# EAGLE design Adafruit Feather Teensy3 Adapter (EAGLE 6.6.0)
COMPANY: ADAFRUIT INDUSTRIES; DRAWN: KTOWN; REV: B
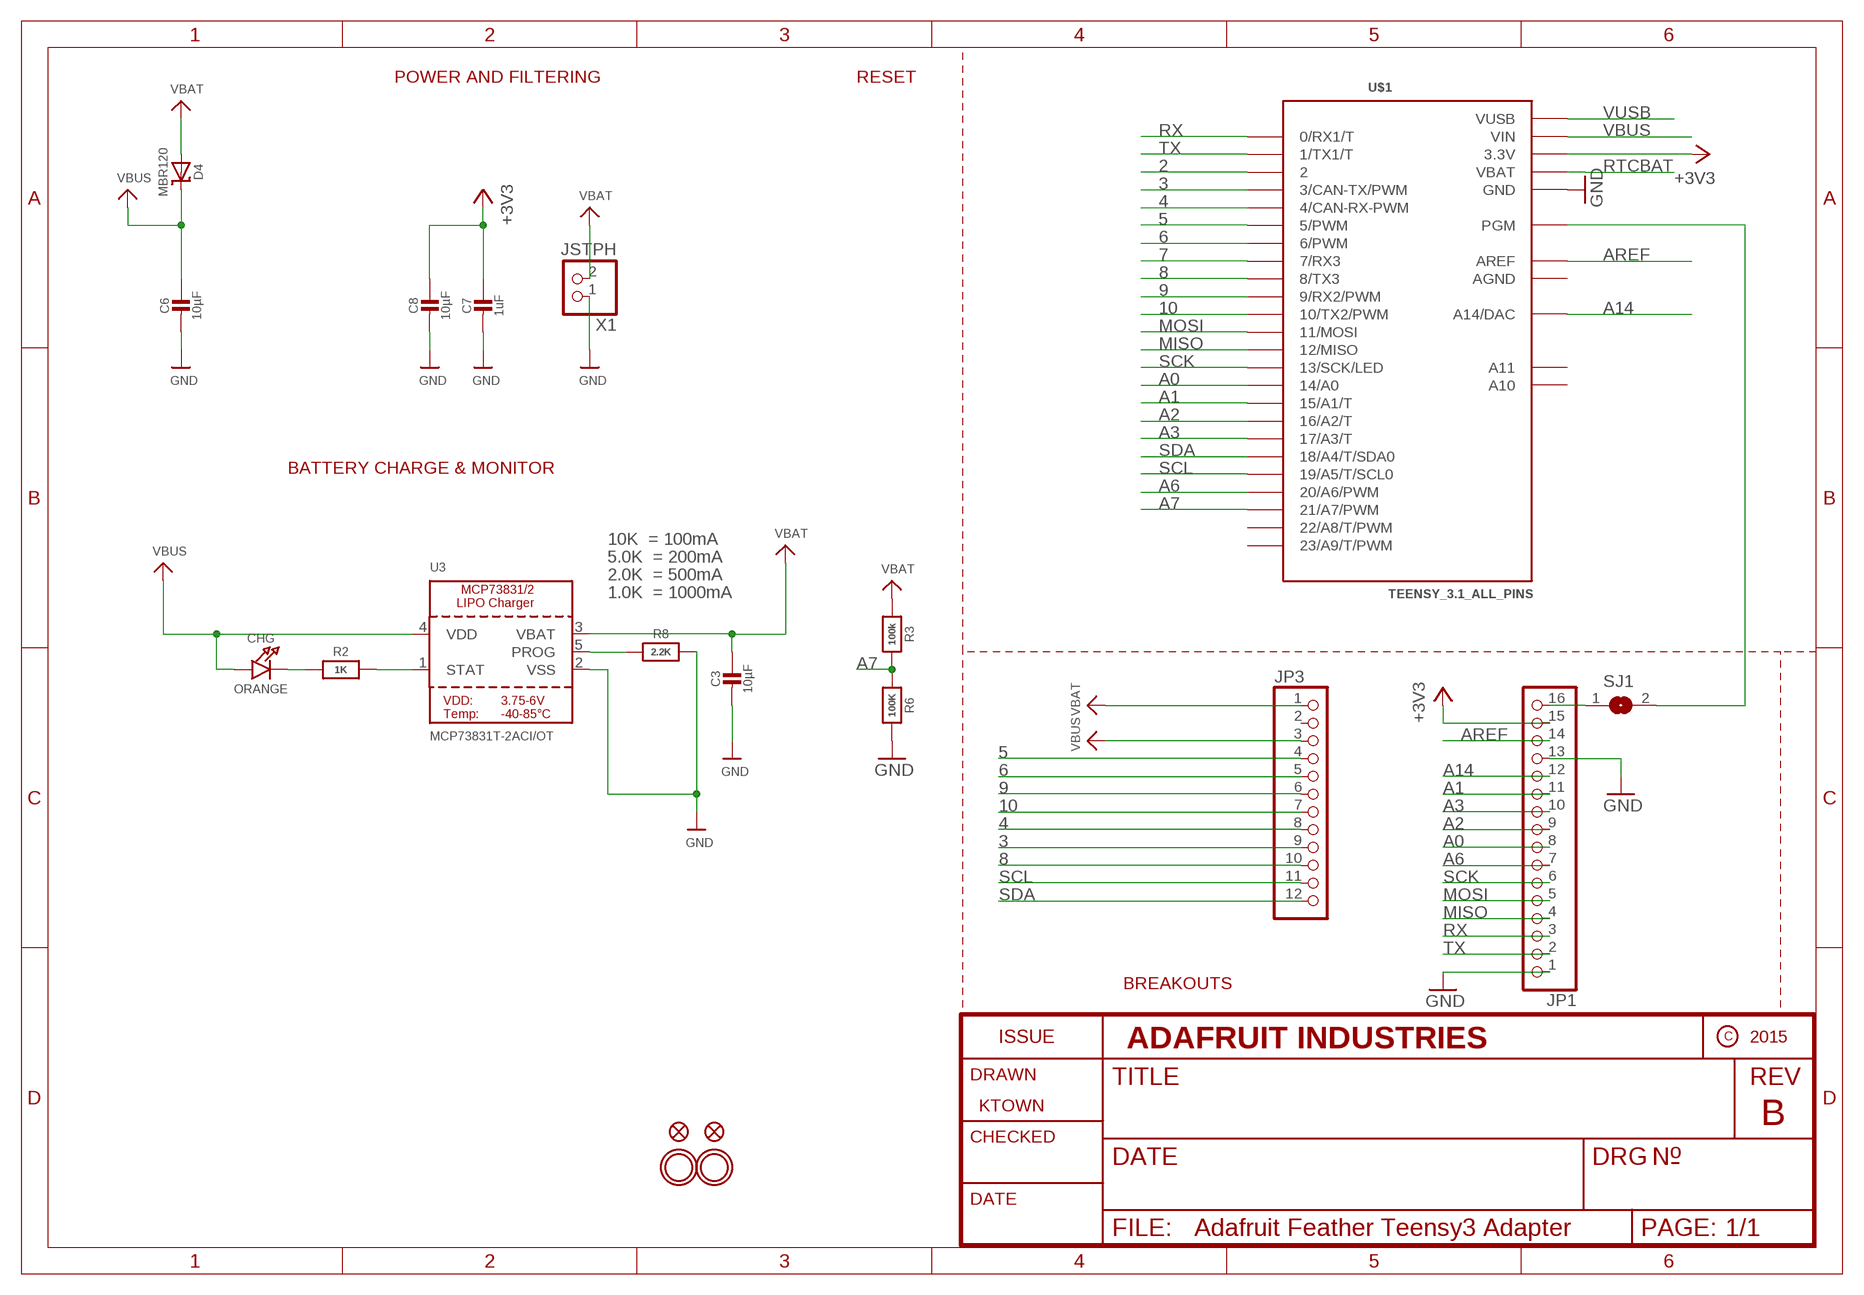
[diagram p0: schematic, sheet 1]

## Parts
C3  10µF  CAP_CERAMIC0805-NOOUTLINE  [0805-NO]
C6  10µF  CAP_CERAMIC0805-NOOUTLINE  [0805-NO]
C7  1uF  CAP_CERAMIC0603_NO  [0603-NO]
C8  10µF  CAP_CERAMIC0805-NOOUTLINE  [0805-NO]
CHG  ORANGE  LED0805_NOOUTLINE  [CHIPLED_0805_NOOUTLINE]
D4  MBR120  DIODE-SCHOTTKYSOD-123  [SOD-123]
JP1  HEADER-1X16ROUND  [1X16_ROUND]
JP3  HEADER-1X12  [1X12_ROUND]
R2  1K  RESISTOR_0603_NOOUT  [0603-NO]
R3  100k  RESISTOR_0603_NOOUT  [0603-NO]
R6  100K  RESISTOR_0603_NOOUT  [0603-NO]
R8  2.2K  RESISTOR_0603_NOOUT  [0603-NO]
SJ1  SOLDERJUMPERCLOSED  [SOLDERJUMPER_CLOSEDWIRE]
U3  MCP73831T-2ACI/OT  MCP73831/2  [SOT23-5]
U$1  TEENSY_3.1_ALL_PINS  [TEENSY3-ALL_PINS]
U$31  MOUNTINGHOLE2.5  [MOUNTINGHOLE_2.5_PLATED]
U$32  MOUNTINGHOLE2.5  [MOUNTINGHOLE_2.5_PLATED]
U$34  FIDUCIAL""  [FIDUCIAL_1MM]
U$35  FIDUCIAL""  [FIDUCIAL_1MM]
X1  JSTPH  CON_JST_PH_2PIN  [JSTPH2]

## Nets
2: U$1.2
3: JP3.9 U$1.3(3/CAN-TX/PWM)
4: JP3.8 U$1.4(4/CAN-RX-PWM)
5: JP3.4 U$1.5(5/PWM)
6: JP3.5 U$1.6(6/PWM)
7: U$1.7(7/RX3)
8: JP3.10 U$1.8(8/TX3)
9: JP3.6 U$1.9(9/RX2/PWM)
10: JP3.7 U$1.10(10/TX2/PWM)
+3V3: C7.1 C8.1 JP1.15 U$1.3.3V U$1.3.3V1(3.3V)
A0: JP1.8 U$1.14/A0
A1: JP1.11 U$1.15/A1(15/A1/T)
A2: JP1.9 U$1.16/A2(16/A2/T)
A3: JP1.10 U$1.17/A3(17/A3/T)
A6: JP1.7 U$1.20/A6(20/A6/PWM)
A7: R3.2 R6.1 U$1.21/A7(21/A7/PWM)
A14: JP1.12 U$1.RESET/DAC(A14/DAC)
AREF: JP1.14 U$1.AREF
BOOT: SJ1.2 U$1.PGM
GND: C3.2 C6.2 C7.2 C8.2 JP1.1 JP1.13 R6.2 R8.2 U3.2(VSS) U$1.GND U$1.GND1(GND) X1.1
MISO: JP1.4 U$1.12(12/MISO)
MOSI: JP1.5 U$1.11(11/MOSI)
N$1: CHG.C R2.1
N$3: R2.2 U3.1(STAT)
N$4: R8.1 U3.5(PROG)
RST/BOOT: JP1.16 SJ1.1
RTCBAT: U$1.VBAT
RX: JP1.3 U$1.0(0/RX1/T)
SCK: JP1.6 U$1.13(13/SCK/LED)
SCL: JP3.11 U$1.19/A5(19/A5/T/SCL0)
SDA: JP3.12 U$1.18/A4(18/A4/T/SDA0)
TX: JP1.2 U$1.1(1/TX1/T)
VBAT: C3.1 D4.A JP3.1 R3.1 U3.3(VBAT) X1.2
VBUS: C6.1 CHG.A D4.C JP3.3 U3.4(VDD) U$1.VIN
VUSB: U$1.VUSB
Unconnected: JP3.2 U$1.22/A8(22/A8/T/PWM) U$1.23/A9(23/A9/T/PWM) U$1.A10 U$1.A11

## Notes on the sheet
- POWER AND FILTERING | RESET
- BATTERY CHARGE & MONITOR
- 10K  = 100mA
- 5.0K  = 200mA
- 2.0K  = 500mA
- 1.0K  = 1000mA
- BREAKOUTS

## Power pins joined to a net without a drawn wire
AGND: U$1.AGND

## Library data of the parts
C3 C6-C8 = microbuilder:CAP_CERAMIC: Ceramic Capacitors For new designs, use the packages preceded by an '_' character since they are more reliable: The following footprints should be used on most boards: _0402 - Standard footprint for regular board layouts _0603 - Standard footprint for regular board layouts _0805 - Standard footprint for regular board layouts _1206 - Standard footprint for regular board layouts For extremely tight-pitch boards where space is at a premium, the following 'micro-pitch' footprints can be used (smaller pads, no silkscreen outline, etc.): _0402MP - Micro-pitch footprint for very dense/compact boards _0603MP - Micro-pitch footprint for very dense/compact boards _0805MP - Micro-pitch footprint for very dense/compact boards _1206MP - Micro-pitch footprint for very dense/compact boards
CHG = microbuilder:LED: LED 0603 - 0603 Surface Mount Package 2mA: Green LED - Low Power (3.9mcd, 2ma, 1.7Vf) - Digikey: 475-2709-2-ND Orange LED - Low Power (9.8mcd, 2ma, 1.8Vf) - Digikey: 475-1194-2-ND Red LED - Low Power (5mcd, 2ma, 1.8Vf) - Digikey: 475-1195-2-ND Yellow LED - Low Power (7mcd, 2ma, 1.8Vf) - Digikey: 475-1196-2-ND 5mA: Blue LED - Low Power (17mcd, 5ma, 2.9Vf) - Digikey: LNJ937W8CRACT-ND 0805 - 0805 Surface Mount Package 2mA: Red LED (8.8mcd, 2mA, 1.8Vf, Clear) - Low Power [Digikey: 475-2510-1-ND] Green LED (5mcd, 2mA, 1.8Vf, Clear) - Low Power [Digikey: 475-2730-1-ND] Yellow LED (11.3mcd, 2mA, 1.8Vf, Clear) - Low Power [Digikey: 475-2555-1-ND] 20mA: Red LED (104mcd, 20mA, Diffused) - LS R976 [Digikey: 475-1278-6-ND] Red LED (12mcd, 20mA, 2.0Vf, Clear) - APT2012EC [Digikey: 754-1128-1-ND] Green LED (15mcd, 20mA, 2.2Vf, Clear) - APT2012GC [Digikey: 754-1131-1-ND] Orange LED (160mcd, 20mA, 2.1Vf, Clear) - APT2012SECK [Digikey: 754-1130-1-ND] 1206 - 1206 Surface Mount Package Green LED (26mcd, 20mA, Diffused) - LG N971 [Digikey: 475-1407-6-ND] Red LED (15mcd, 20mA, Diffused) - LH N974 [Digikey: 475-1416-6-ND] Cree - Cree High-Power Surface Mount LEDs XPEBWT-L1-0000-00D50 - White 111lm 350mA 2.9Vf 6200K 110° XTEAWT-00-0000-00000LEE3 - White 114lm 350mA 2.85Vf 5000K 115° Everlight - Everlight 45-21 Series Surface Mount LEDs 45-21/QK2C-B2832AC2CB2/2T - Warm White 2000mcd 20mA 3.25Vf 3050K 120° 45-21/LK2C-B38452C4CB2/2T - Nuetral White 2000mcd 20mA 3.25Vf 4150K 120° 45-21/LK2C-B50634C6CB2/2T - Cold White 2200mcd 20mA 3.25Vf 5650K 120° PLCC2 Reverse Mount LS T77K-J1L2-1-0-2-R18-Z - Red 11.25mcd 2mA 1.8Vf 630nm 120° LO T77K-L1M2-24-Z - Orange 19.6mcd 2mA 1.8Vf 606nm 120° LY T77K-K2M1-26-Z - Yellow 15.7mcd 2mA 1.8Vf 587nm 120°
D4 = microbuilder:DIODE-SCHOTTKY
JP1 = microbuilder:HEADER-1X16: PIN HEADER
JP3 = microbuilder:HEADER-1X12
R2 R3 R6 R8 = microbuilder:RESISTOR: Resistors For new designs, use the packages preceded by an '_' character since they are more reliable: The following footprints should be used on most boards: _0402 - Standard footprint for regular board layouts _0603 - Standard footprint for regular board layouts _0805 - Standard footprint for regular board layouts _1206 - Standard footprint for regular board layouts For extremely tight-pitch boards where space is at a premium, the following 'micro-pitch' footprints can be used (smaller pads, no silkscreen outline, etc.): _0402MP - Micro-pitch footprint for very dense/compact boards _0603MP - Micro-pitch footprint for very dense/compact boards _0805MP - Micro-pitch footprint for very dense/compact boards _1206MP - Micro-pitch footprint for very dense/compact boards
SJ1 = microbuilder:SOLDERJUMPER: SMD Solder JUMPER Solder the two pads together to create a connection, or remove the solder to break it. REFLOW - Use this footprint for solder paste and reflow ovens. WAVE - Use this footprint for hand-soldering (larger pads). CLOSED - Has a trace between the two pads to ensure it is closed by default. The trace needs to be cut to disable the jumper, and can be closed again by creating a solder bridge between the two pads.
U3 = microbuilder:MCP73831/2: MCP73831/2 LIPO Charger VDD: 3.75 - 6V Temp -40 - 85°C Programmable Charge Rate: 15-500mA NOTE: STAT is a tri-state logic output on the MCP73831 and an open-drain output on the MCP73832. SOT23-5 with 4.2V output and tri-state logic on STAT = MCP73831T-2ACI/OT
U$1 = microbuilder:TEENSY_3.1_ALL_PINS: Footprint for Teensy 3.1 or 3.2 board using all through-holes, i.e. the entire perimeter plus the 4 through-holes inboard (A10,A11,AREF, VUSB)
U$31 U$32 = microbuilder:MOUNTINGHOLE: Mounting Hole For #2 screws (0.086"/2.18mm width, 0.094"/2.4mm hole) use 2.5mm; BOM: EXCLUDE
U$34 U$35 = microbuilder:FIDUCIAL: Fiducial Alignment Points Various fiducial points for machine vision alignment.; BOM: EXCLUDE
X1 = microbuilder:CON_JST_PH_2PIN: JST 2-Pin Right-Angle Connector PH-Series - 4UConnector: 17311 SH-Series - 4UConnector: 07278

## Board
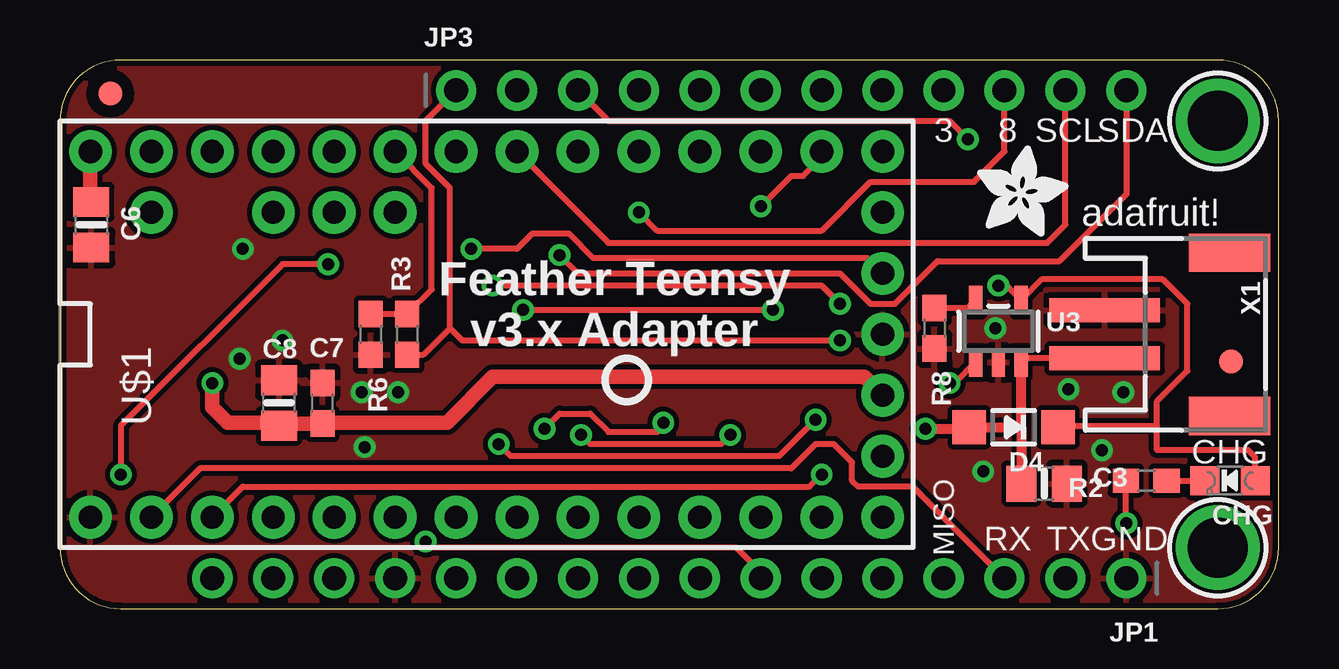
[diagram p1: board, top side]
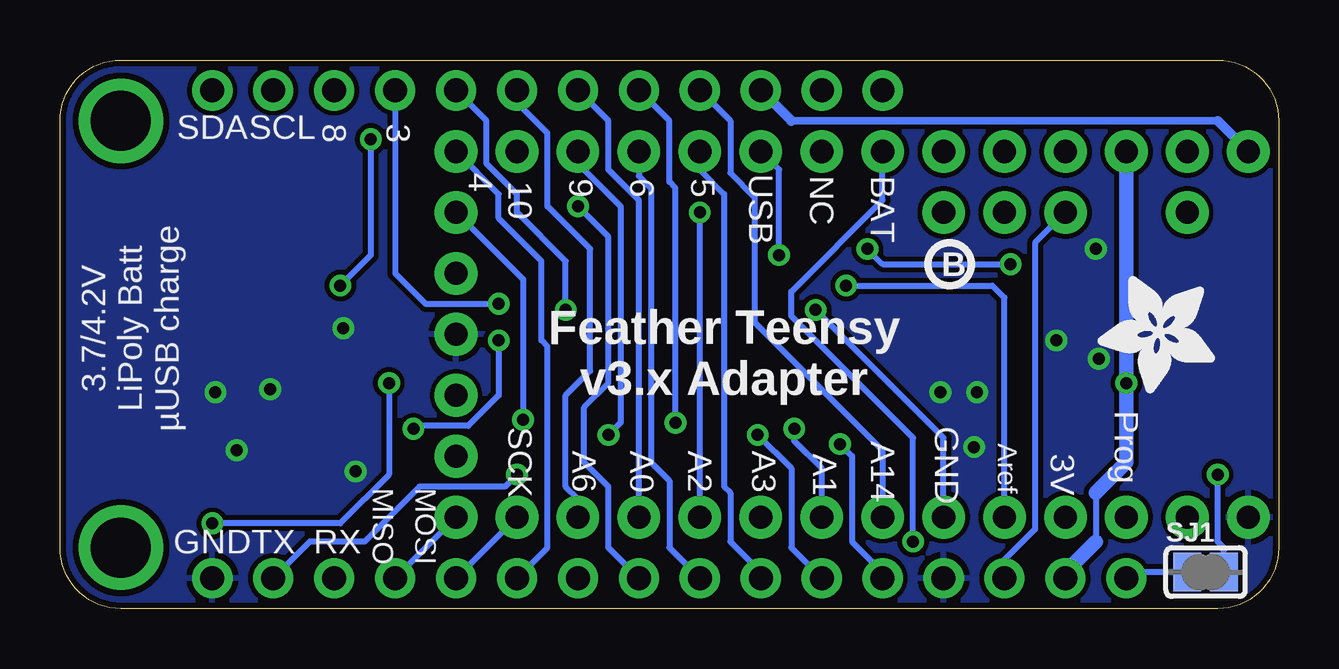
[diagram p2: board, bottom side, seen from below]

Size 50.8 x 22.86 mm. Coordinates in mm from the lower left corner, seen from the top.
Outline: 2.54,0 48.26,0 arc90 50.8,2.54 50.8,20.32 arc90 48.26,22.86 2.54,22.86 arc90 0,20.32 0,2.54 arc90 2.54,0
Copper layers (1*16): Top 0.035mm / dielectric 1.5mm / Bottom 0.035mm
Design rules "adafruit *": minimum track width 8mil, minimum drill 15.5mil, track to track 8mil, track to pad 8mil, pad to pad 8mil, via to via 8mil, smd to smd 8mil, copper to edge 10mil, drill to drill 8mil, minimum pad ring 10mil, minimum via ring 8mil, stop-mask expansion 2mil, vias tented up to drill 20mil, thermal gap 10mil

### Footprints (pad centres in the part's own frame; a part is rotated, then mirrored left to right if it is on the bottom)
0805-NO = smd 1.24 x 1.5: 1 -0.95,0; 2 0.95,0
0603-NO = smd 1.1 x 1: 1 -0.85,0; 2 0.85,0
CHIPLED_0805_NOOUTLINE = smd 1.2 x 1.2: A 0,-1.05; C 0,1.05
SOD-123 = smd 1.4 x 1.4: A 1.85,0; C -1.85,0
1X16_ROUND = drill 1 pad 1.676: 1 -19.05,0; 2 -16.51,0; 3 -13.97,0; 4 -11.43,0; 5 -8.89,0; 6 -6.35,0; 7 -3.81,0; 8 -1.27,0; 9 1.27,0; 10 3.81,0; 11 6.35,0; 12 8.89,0; 13 11.43,0; 14 13.97,0; 15 16.51,0; 16 19.05,0
1X12_ROUND = drill 1 pad 1.676: 1 -13.97,0; 2 -11.43,0; 3 -8.89,0; 4 -6.35,0; 5 -3.81,0; 6 -1.27,0; 7 1.27,0; 8 3.81,0; 9 6.35,0; 10 8.89,0; 11 11.43,0; 12 13.97,0
SOLDERJUMPER_CLOSEDWIRE = smd 1.168 x 1.6: 1 -0.762,0; 2 0.762,0 | smd 0.635 x 0.203: WIRE 0,0
SOT23-5 = smd 0.55 x 1.2: 1 -0.95,-1.3; 2 0,-1.3; 3 0.95,-1.3; 4 0.95,1.3; 5 -0.95,1.3
TEENSY3-ALL_PINS = drill 0.965 pad 1.778: 0 -7.62,13.97; 1 -7.62,11.43; 2 -7.62,8.89; 3 -7.62,6.35; 3.3V 7.62,11.43; 3.3V1 -2.54,-16.51; 4 -7.62,3.81; 5 -7.62,1.27; 6 -7.62,-1.27; 7 -7.62,-3.81; 8 -7.62,-6.35; 9 -7.62,-8.89; 10 -7.62,-11.43; 11 -7.62,-13.97; 12 -7.62,-16.51; 13 7.62,-16.51; 14/A0 7.62,-13.97; 15/A1 7.62,-11.43; 16/A2 7.62,-8.89; 17/A3 7.62,-6.35; 18/A4 7.62,-3.81; 19/A5 7.62,-1.27; 20/A6 7.62,1.27; 21/A7 7.62,3.81; 22/A8 7.62,6.35; 23/A9 7.62,8.89; A10 5.08,6.35; A11 5.08,3.81; AGND 7.62,13.97; AREF 5.08,8.89; GND -7.62,16.51; GND1 0,-16.51; PGM 2.54,-16.51; RESET/DAC 5.08,-16.51; VBAT -5.08,-16.51; VIN 7.62,16.51; VUSB 5.08,13.97
MOUNTINGHOLE_2.5_PLATED = drill 2.5 pad 3.2: P$1 0,0
FIDUCIAL_1MM = smd 1 x 1: 1 0,0
JSTPH2 = smd 1 x 4.6: 1 -1,-3.7; 2 1,-3.7 | smd 1.6 x 3.4: NC1 -3.4,1.5; NC2 3.4,1.5

### Placement (x,y rotation side)
C3  41.02,5.21 0 top
C6  1.31,16 270 top
C7  10.94,8.56 90 top
C8  9.13,8.57 90 top
CHG  48.77,5.33 90 top
D4  39.75,7.56 180 top
JP1  25.4,1.27 180 top
JP3  30.48,21.59 0 top
R2  45.28,5.33 180 top
R3  14.48,11.43 90 top
R6  12.95,11.43 270 top
R8  36.45,11.68 270 top
SJ1  3.05,1.52 0 bottom
U3  39.12,11.56 0 top
U$1  17.78,11.43 90 top
U$4  [ADAFRUIT_5MM]  2.67,13.84 180 bottom
U$5  [PCBFEAT-REV-040]  23.62,9.53 0 top
U$6  [PCBFEAT-REV-040]  13.72,14.35 0 bottom
U$7  [ADAFRUIT_3.5MM]  38.23,15.49 0 top
U$31  48.26,20.32 270 top
U$32  48.26,2.54 270 top
U$34  2.1,21.46 270 top
U$35  48.82,10.29 270 top
X1  47.24,11.43 270 top

### Tracks (layer width: path | path; a pad name or v marks a point on that pad's centre or on a via)
3  (via drill 0.5)
  Top 0.254: v32.51,12.7 31.75,13.46 v18.03,13.46
  Bottom 0.254: U$1.3 11.43,12.95 11.94,13.46 v18.03,13.46 | JP3.9 36.83,13.97 35.56,12.7 v32.51,12.7
4  (via drill 0.5)
  Top 0.254: v19.3,12.45 v29.72,12.45
  Bottom 0.254: U$1.4 13.97,7.11 v19.3,12.45 | v29.72,12.45 29.72,14.48 31.75,16.51 31.75,17.27 33.02,18.54 33.02,20.32 JP3.8
5
  Bottom 0.254: JP3.4 22.86,20.32 22.86,18.16 21.84,17.14 21.84,11.94 16.51,6.6 U$1.5
6  (via drill 0.5)
  Top 0.254: v20.19,7.49 20.83,8.13 22.1,8.13 22.86,7.37 24.89,7.37 25.15,7.62 v25.15,7.75
  Bottom 0.254: U$1.6 19.05,5.84 20.19,6.99 v20.19,7.49 | v25.15,7.75 25.15,17.53 25.4,17.78 25.4,20.32 JP3.5
8  (via drill 0.5)
  Top 0.254: v24.13,16.51 24.89,15.75 31.75,15.75 33.78,17.78 38.1,17.78 39.37,19.05 JP3.10 39.37,21.34
  Bottom 0.254: U$1.8 v24.13,16.51
9
  Bottom 0.254: U$1.9 26.67,17.02 27.94,18.29 27.94,20.32 JP3.6
10
  Bottom 0.254: U$1.10 29.21,4.57 29.72,5.08 29.72,8.89 28.7,9.91 28.7,14.99 30.48,16.76 30.48,19.81 31.75,21.08 JP3.7
+3V3  (via drill 0.5)
  Top 0.61: 6.24,18.94 U$1.3.3V | U$1.3.3V1 33.53,9.65 18.03,9.65 16.13,7.75 10.94,7.75 C7.1 9.13,7.71 C8.1 9.13,7.75 6.99,7.75 6.35,8.38 v6.35,9.4
  Bottom 0.254: 7.62,4.83 7.62,2.79
  Bottom 0.61: U$1.3.3V v6.35,9.4 6.35,6.1 7.62,4.83 | 7.62,2.79 8.89,1.52 JP1.15
A0  (via drill 0.5)
  Top 0.254: v29.21,16.76 30.48,18.03 30.99,18.03 31.75,18.8 U$1.14/A0
  Bottom 0.254: JP1.8 27.94,2.54 27.94,5.08 28.96,6.1 28.96,8.38 27.94,9.4 27.94,15.49 v29.21,16.76
A1  (via drill 0.5)
  Top 0.254: v27.94,7.24 27.56,6.86 22.1,6.86 v21.72,7.24
  Bottom 0.254: U$1.15/A1 29.21,18.54 27.43,16.76 27.43,7.75 v27.94,7.24 | v21.72,7.24 20.32,5.84 20.32,2.54 JP1.11
A2
  Bottom 0.254: U$1.16/A2 26.67,18.03 26.16,17.53 26.16,6.1 25.4,5.33 25.4,2.54 JP1.9
A3
  Bottom 0.254: U$1.17/A3 24.13,18.29 23.11,17.27 23.11,5.08 22.86,4.83 22.86,2.79 21.59,1.52 JP1.10
A6  (via drill 0.5)
  Top 0.254: JP1.7 29.21,1.52 28.19,2.54 15.49,2.54 v15.24,2.79
  Bottom 0.254: v15.24,2.79 15.24,7.11 20.32,12.19 20.32,13.21 16.51,17.02 U$1.20/A6
A7
  Top 0.254: R6.1 R3.2 15.49,13.3 15.49,17.53 U$1.21/A7
A14  (via drill 0.5)
  Top 0.254: v31.5,7.87 29.97,6.35 18.8,6.35 v18.29,6.86
  Bottom 0.254: U$1.RESET/DAC 31.5,13.72 v31.5,7.87 | v18.29,6.86 17.78,6.35 17.78,2.79 16.51,1.52 JP1.12
AREF
  Bottom 0.254: U$1.AREF 10.16,15.24 10.16,3.3 11.43,2.03 JP1.14
BOOT  (via drill 0.5)
  Top 0.254: U$1.PGM 33.66,14.61 22.23,14.61 21.21,15.62 19.68,15.62 19.05,14.99 v17.14,14.99 | v11.18,14.35 9.27,14.35 2.54,7.62 v2.54,5.59
  Bottom 0.254: SJ1.2 2.29,2.54 2.54,2.79 v2.54,5.59 | v17.14,14.99 16.51,14.35 v11.18,14.35
GND  (via drill 0.5)
  other vias: 38.99,11.68 42.04,9.14 44.32,9.02 43.43,6.6 38.48,5.71 14.1,9.02 12.57,9.02 12.7,6.73 7.62,14.99 7.49,10.41 9.27,11.18
  pour Top: 0,22.86 0,0 50.8,0 50.8,22.86
  pour Bottom: 0,22.86 0,0 50.8,0 50.8,22.86
MISO
  Bottom 0.254: U$1.12 JP1.4
MOSI
  Bottom 0.254: U$1.11 JP1.5
N$1
  Top 0.254: R2.1 CHG.C
N$3  (via drill 0.5)
  Top 0.254: U3.1 37.31,9.4 v37.08,9.4 | v44.45,3.56 44.42,3.58 R2.2
  Bottom 0.254: v37.08,9.4 37.08,5.59 39.12,3.56 v44.45,3.56
N$4
  Top 0.254: R8.1 37.84,12.53 U3.5
RST/BOOT
  Bottom 0.254: SJ1.1 6.1,1.52 JP1.16
RX
  Top 0.254: U$1.0 5.84,5.84 30.48,5.84 31.5,6.86 32.26,6.86 33.02,6.1 33.02,5.33 33.27,5.08 35.56,5.08 JP1.3
SCK
  Bottom 0.254: JP1.6 30.48,2.54 30.48,10.92 30.73,11.18 30.73,14.48 32.51,16.26 32.51,17.27 U$1.13
SCL
  Top 0.254: U$1.19/A5 22.86,15.24 41.15,15.24 41.91,16 JP3.11
SDA  (via drill 0.5)
  Top 0.254: JP3.12 44.45,17.27 41.66,14.48 36.58,14.48 34.8,12.7 33.78,12.7 32.51,13.97 21.59,13.97 v20.83,14.73
  Bottom 0.254: v20.83,14.73 20.83,18.29 U$1.18/A4
TX  (via drill 0.5)
  Top 0.254: U$1.1 7.62,5.08 31.24,5.08 v31.75,5.59
  Bottom 0.254: v31.75,5.59 32.26,5.08 35.81,5.08 38.1,2.79 40.39,2.79 JP1.2
VBAT  (via drill 0.5)
  Top 0.254: R3.1 15.15,10.58 16.26,11.68 | 16.26,11.68 16.26,17.53 15.24,18.54 15.24,20.32 JP3.1 | X1.2 40.24,10.43 U3.3 | 16.26,11.68 16.76,11.18 v32.51,11.18
  Top 0.406: U3.3 40.07,7.56 | 40.07,7.56 C3.1 | 40.07,7.56 D4.A 37.84,7.49 v36.07,7.49
  Bottom 0.254: v32.51,11.18 32.51,8.89 33.78,7.62 36.07,7.62 v36.07,7.49
VBUS  (via drill 0.5)
  Top 0.254: 1.27,16.99 C6.1 | CHG.A 49.82,6.32 49.53,6.6 45.72,6.6 45.72,7.62 | 45.72,7.62 45.72,8.64 46.99,9.91 46.99,12.7 45.97,13.72 40.92,13.72 U3.4 39.46,13.46 v39.12,13.46 | JP3.3 22.86,20.32 37.08,20.32 v37.85,19.56 | D4.C 41.66,7.62 45.72,7.62
  Top 0.61: U$1.VIN 1.27,16.99
  Bottom 0.254: v37.85,19.56 37.85,14.73 v39.12,13.46
  Bottom 0.305: 2.54,20.32 20.32,20.32
  Bottom 0.406: U$1.VIN 2.54,20.32 | 20.32,20.32 JP3.3

### Text on the board
tPlace: 3 | 8 | SCL | SDA | adafruit! | Feather Teensy / v3.x Adapter | CHG | MISO | RX | TX | GND
bPlace: 3 | 8 | SCL | SDA | 5 | 6 | 9 | 4 | BAT | NC | USB | 10 | 3.7/4.2V / LiPoly Batt / µUSB charge | Feather Teensy / v3.x Adapter | Prog | 3V | Aref | GND | A14 | A1 | A3 | A2 | A0 | A6 | SCK | MOSI | MISO | RX | TX | GND